# Altium schematic sheet Sheet1.SchDoc
size B; PageSetup: Record=PageOptions|CenterHorizontal=True|CenterVertical=True|PrintScale=1.09|XCorrection=1.00|YCorrection=1.00|PrintKind=1|BorderSize=5000000|LeftOffset=0|BottomOffset=0|Orientation=2|PaperLength=4318|PaperWidth=2794|Scale=100|PaperSource=7|PrintQuality=600|MediaType=1|DitherType=10|PaperKind=11" x 17"|PrintScaleMode=1
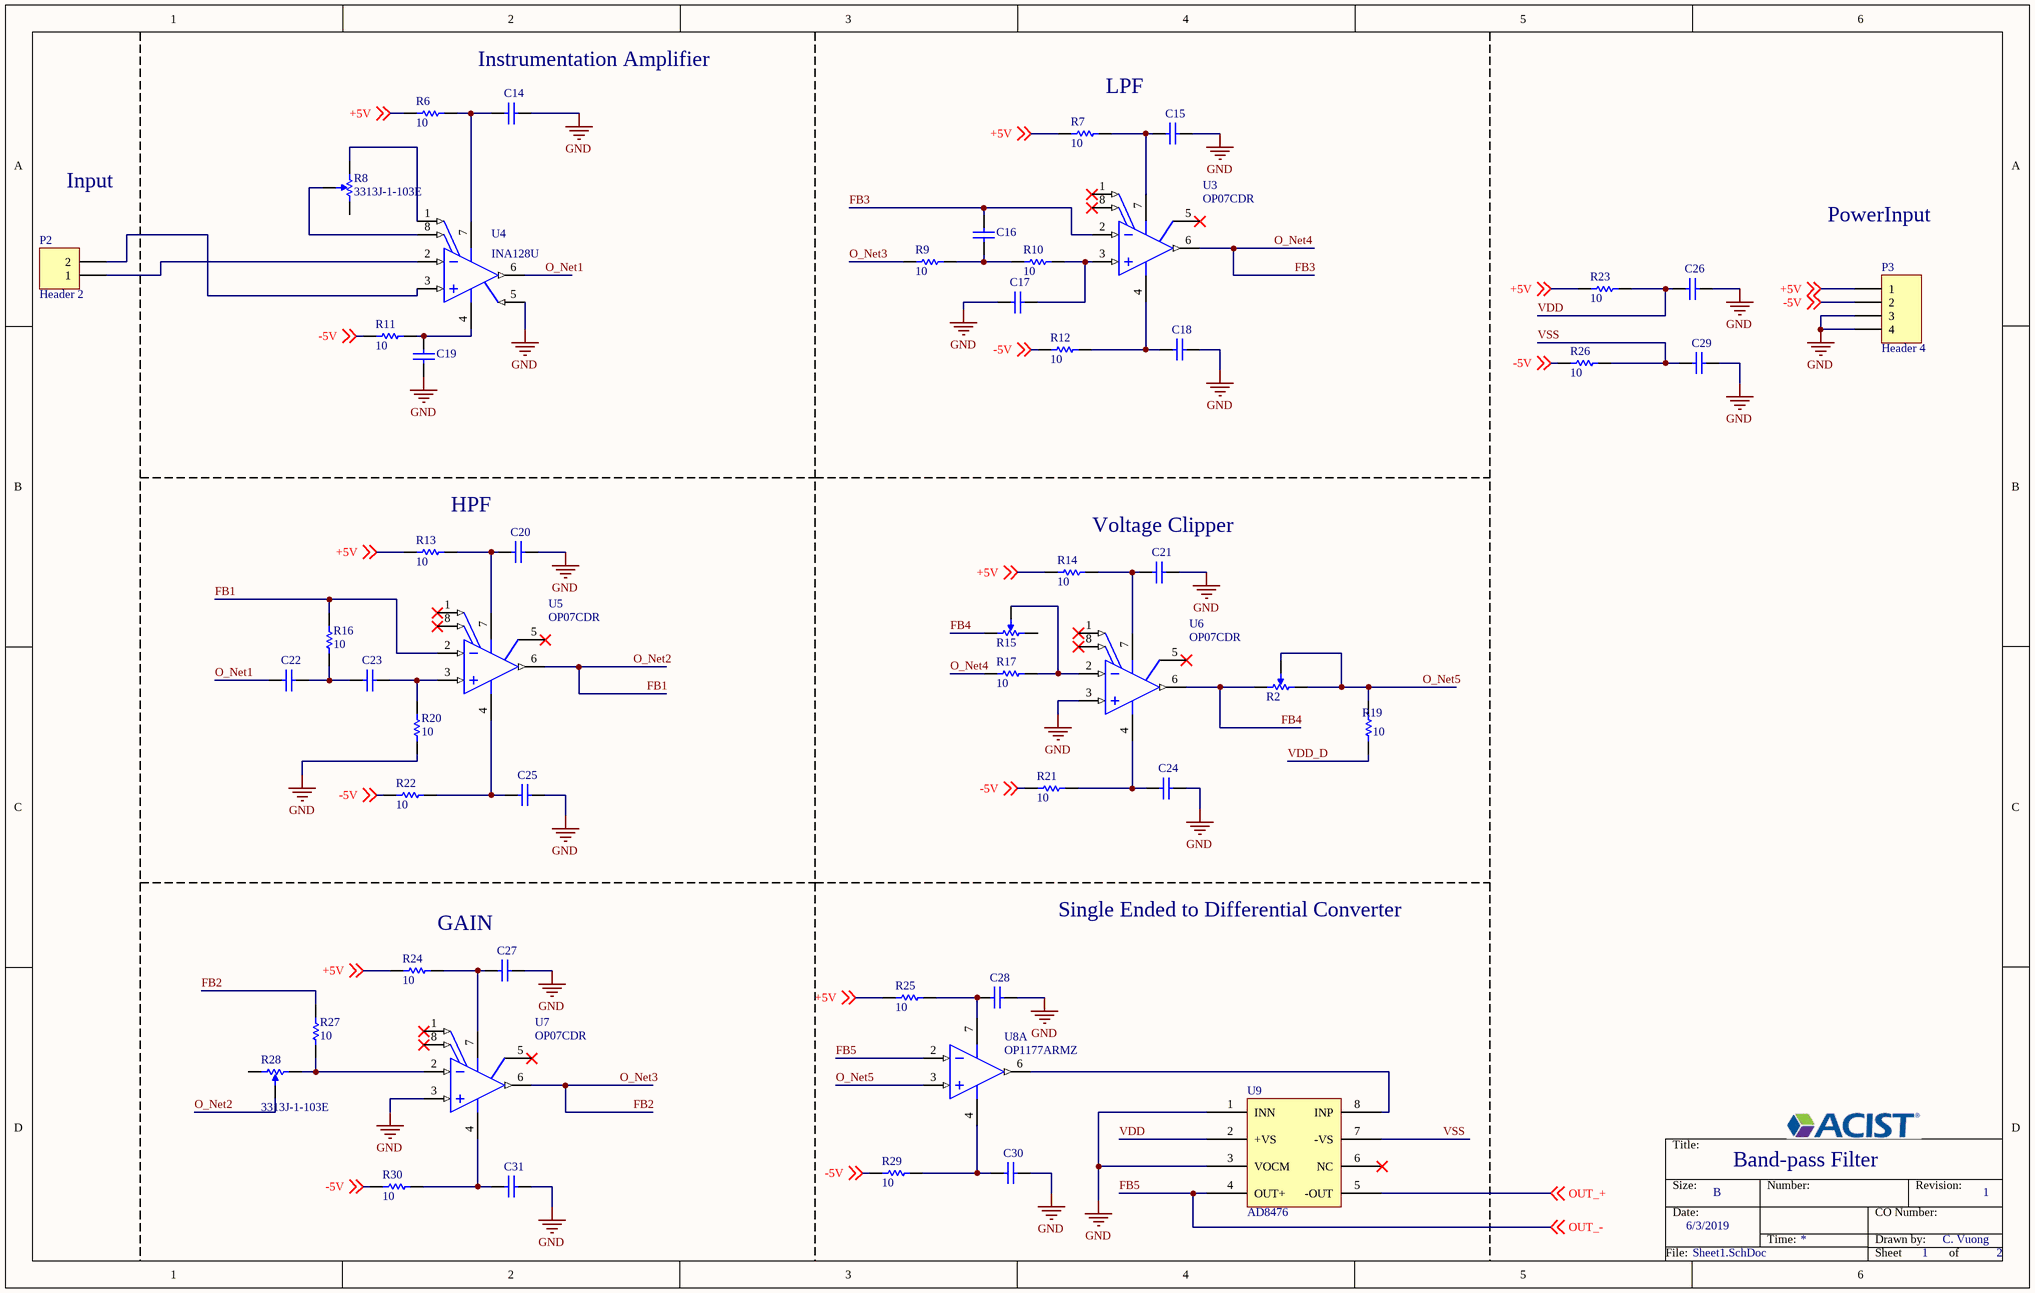
[diagram p0: Sheet1.SchDoc]

## Parts
C14  C1608X5R1A106K080AC  [CAPC1608X90X20ML10]  (value not drawn)
C15  C1608X5R1A106K080AC  [CAPC1608X90X20ML10]  (value not drawn)
C16  C1608X5R1A106K080AC  [CAPC1608X90X20ML10]  (value not drawn)
C17  C1608X5R1A106K080AC  [CAPC1608X90X20ML10]  (value not drawn)
C18  C1608X5R1A106K080AC  [CAPC1608X90X20ML10]  (value not drawn)
C19  C1608X5R1A106K080AC  [CAPC1608X90X20ML10]  (value not drawn)
C20  C1608X5R1A106K080AC  [CAPC1608X90X20ML10]  (value not drawn)
C21  C1608X5R1A106K080AC  [CAPC1608X90X20ML10]  (value not drawn)
C22  C1608X5R1A106K080AC  [CAPC1608X90X20ML10]  (value not drawn)
C23  C1608X5R1A106K080AC  [CAPC1608X90X20ML10]  (value not drawn)
C24  C1608X5R1A106K080AC  [CAPC1608X90X20ML10]  (value not drawn)
C25  C1608X5R1A106K080AC  [CAPC1608X90X20ML10]  (value not drawn)
C26  C1608X5R1A106K080AC  [CAPC1608X90X20ML10]  (value not drawn)
C27  C1608X5R1A106K080AC  [CAPC1608X90X20ML10]  (value not drawn)
C28  C1608X5R1A106K080AC  [CAPC1608X90X20ML10]  (value not drawn)
C29  C1608X5R1A106K080AC  [CAPC1608X90X20ML10]  (value not drawn)
C30  C1608X5R1A106K080AC  [CAPC1608X90X20ML10]  (value not drawn)
C31  C1608X5R1A106K080AC  [CAPC1608X90X20ML10]  (value not drawn)
P2  Header 2  [HDR1X2]
P3  Header 4  [HDR1X4]
R2  3313J-1-103E  [BOUR-3313J-1_V]  (value not drawn)
R6  10  [RESC1608X50X30LL20T20]
R7  10  [RESC1608X50X30LL20T20]
R8  3313J-1-103E  [BOUR-3313J-1_V]
R9  10  [RESC1608X50X30LL20T20]
R10  10  [RESC1608X50X30LL20T20]
R11  10  [RESC1608X50X30LL20T20]
R12  10  [RESC1608X50X30LL20T20]
R13  10  [RESC1608X50X30LL20T20]
R14  10  [RESC1608X50X30LL20T20]
R15  3313J-1-103E  [BOUR-3313J-1_V]  (value not drawn)
R16  10  [RESC1608X50X30LL20T20]
R17  10  [RESC1608X50X30LL20T20]
R19  10  [RESC1608X50X30LL20T20]
R20  10  [RESC1608X50X30LL20T20]
R21  10  [RESC1608X50X30LL20T20]
R22  10  [RESC1608X50X30LL20T20]
R23  10  [RESC1608X50X30LL20T20]
R24  10  [RESC1608X50X30LL20T20]
R25  10  [RESC1608X50X30LL20T20]
R26  10  [RESC1608X50X30LL20T20]
R27  10  [RESC1608X50X30LL20T20]
R28  3313J-1-103E  [BOUR-3313J-1_V]
R29  10  [RESC1608X50X30LL20T20]
R30  10  [RESC1608X50X30LL20T20]
U3  OP07CDR  [D0008A_M]
U4  INA128U  [D0008A_N]
U5  OP07CDR  [D0008A_M]
U6  OP07CDR  [D0008A_M]
U7  OP07CDR  [D0008A_M]
U8  OP1177ARMZ  [ADI-RM-8_M]  (part A of 2)
U9  AD8476  [MSOP8]

## Nets
GND: C14.1 C15.1 C17.1 C18.1 C19.1 C20.1 C21.1 C24.1 C25.1 C26.1 C27.1 C28.1 C29.1 C30.1 C31.1 P3.3 P3.4 R20.2 U4.5(REF) U6.3(IN+) U7.3(IN+) U9.1(INN) U9.3(VOCM)
+5V: P3.1 R6.2 R7.2 R13.2 R14.2 R23.2 R24.2 R25.2 ; off-sheet +5V
-5V: P3.2 R11.2 R12.2 R21.2 R22.2 R26.2 R29.2 R30.2 ; off-sheet -5V
FB1: R16.1 R28.2 U5.2(IN-) U5.6(OUT)  [also labelled O_Net2]
FB2: R9.2 R27.1 U7.6(OUT)  [also labelled O_Net3]
FB3: C16.1 R17.2 U3.2(IN-) U3.6(OUT)  [also labelled O_Net4]
FB4: R2.3 R15.3 U6.6(OUT)
FB5: U8.2(-IN) U9.4(OUT+) ; off-sheet OUT_-  [also labelled OUT_-]
O_Net1: C22.2 U4.6(VO)
O_Net5: R2.1 R2.2 R19.1 U8.3(+IN)
OUT_+: U9.5(-OUT) ; off-sheet OUT_+
VDD: C26.2 R23.1 U9.2(+VS)
VDD_D: R19.2
VSS: C29.2 R26.1 U9.7(-VS)
NetC14_2: C14.2 R6.1 U4.7(V+)
NetC15_2: C15.2 R7.1 U3.7(VCC+)
NetC16_2: C16.2 R9.1 R10.2
NetC17_2: C17.2 R10.1 U3.3(IN+)
NetC18_2: C18.2 R12.1 U3.4(VCC-)
NetC19_2: C19.2 R11.1 U4.4(V-)
NetC20_2: C20.2 R13.1 U5.7(VCC+)
NetC21_2: C21.2 R14.1 U6.7(VCC+)
NetC22_1: C22.1 C23.2 R16.2
NetC23_1: C23.1 R20.1 U5.3(IN+)
NetC24_2: C24.2 R21.1 U6.4(VCC-)
NetC25_2: C25.2 R22.1 U5.4(VCC-)
NetC27_2: C27.2 R24.1 U7.7(VCC+)
NetC28_2: C28.2 R25.1 U8.7(+V)
NetC30_2: C30.2 R29.1 U8.4(-V)
NetC31_2: C31.2 R30.1 U7.4(VCC-)
NetP2_1: P2.1 U4.2(VIN-)
NetP2_2: P2.2 U4.3(VIN+)
NetR8_1: R8.1 U4.1(RG)
NetR8_2: R8.2 U4.8(RG)
NetR15_2: R15.2 R17.1 U6.2(IN-)
NetR27_2: R27.2 R28.3 U7.2(IN-)
NetU8_6: U8.6(OUT) U9.8(INP)

Not connected (* = marked no-connect by the designer): R8 3; R15 1; R28 1; U3 1(OFFSET_N1)* 5(NC)* 8(OFFSET_N2)*; U5 1(OFFSET_N1)* 5(NC)* 8(OFFSET_N2)*; U6 1(OFFSET_N1)* 5(NC)* 8(OFFSET_N2)*; U7 1(OFFSET_N1)* 5(NC)* 8(OFFSET_N2)*; U9 6(NC)*

## Notes on the sheet
- Instrumentation Amplifier
- LPF
- Input
- PowerInput
- HPF
- Voltage Clipper
- GAIN
- Single Ended to Differential Converter
- Band-pass Filter
- 6/3/2019
- C. Vuong
- 1
- 2
- Title:
- Size:
- Date:
- B
- Number:
- Time:
- CO Number:
- Drawn by:
- Revision:
- File:
- Sheet
- of

## Library data of the parts
C14-C31 = CMP-2000-04979-1: Chip Capacitor, 10 uF, +/- 10%, 10 V, -55 to 85 degC, 0603 (1608 Metric), RoHS, Tape and Reel; PCN Part Number: MLCCPartNumberChange30/Nov/2012; Manufacturer: TDK; Temperature Coefficient: X5R; Product Training Modules: CSeriesGeneralApplicationsSEAT,CCV,andTVCLDesignToolsGuidetoReplacinganElectrolyticCapacitorwithanMLCC; Online Catalog: CSeries,GeneralPurpose; Voltage - Rated: 10V; Other Names: 445-7486-1; Capacitance: 10µF; Design Resources: 20WNon-IsolatedBuckLEDDriverUsingPLLNK460KG; Kits: 445-9003-KIT-ND-KITCAPCERHICAPMLCCSMD; Height - Seated (Max): -; Family: CeramicCapacitors; Package Description: 2-Pin Surface Mount Device, Body 1.6 x 0.8 mm; Category: Capacitors; Datasheet Version: Mar-15; RoHS Information: RoHSCertificate-MLCC; Thickness (Max): 0.035"(0.90mm); Operating Temperature: -55degC~85degC; Package Reference: 603; Series: C; Applications: GeneralPurpose; Datasheet URL: http://download.siliconexpert.com/pdfs/2015/4/21/15/54/45/779/tdk_/manual/37024850441143360mlcc_commercial_general_en.pdf; Features: -; Lead Style: -; Lead Spacing: -; Ratings: -; Size / Dimension: 0.063"Lx0.031"W(1.60mmx0.80mm); Tolerance: ±10%; Mounting Type: SurfaceMount,MLCC; Standard Package: 1; Package / Case: 0603(1608Metric); Manufacturer URL: http://www.tdk.com/; Packaging: CutTape(CT)
P2 = Header 2: Header, 2-Pin; LatestRevisionDate: 17-Jul-2002; LatestRevisionNote: Re-released for DXP Platform.; Publisher: Altium Limited
P3 = Header 4: Header, 4-Pin; LatestRevisionDate: 17-Jul-2002; LatestRevisionNote: Re-released for DXP Platform.; Publisher: Altium Limited
R2 R8 R15 R28 = CMP-2000-05585-1: Trimming Potentiometer, 10 KOhm, -55 to 125 degC, 3-Pin SMD, RoHS, Tape and Reel; Manufacturer: Bourns; Resistance Tolerance: ±20%; Track Resistance: 10kohm; SVHC: NoSVHC(16-Jun-2014); No. of Turns: 1; Temperature Coefficient: ±100ppm/°C; Power Rating: 125mW; Potentiometer Mounting: SMD; RoHS Compliant: Yes; Datasheet URL: http://www.bourns.com/docs/Product-Datasheets/3313.pdf; Mounting Technology: SurfaceMount; Manufacturer URL: http://www.bourns.com/; Package Description: 3-Pin Surface Mount Device, Body 3.5 x 3.2 mm, Pitch 1.15 mm; Package Reference: 3313J-1; Datasheet Version: 05/2016
R6 R7 R9-R14 R16 R17 R19-R27 R29 R30 = CMP-2000-02559-1: Part Number: RR0816P-241-D; Manufacturer: Susumu
U3 U5-U7 = CMP-0015-00070-2: Low-Offset Voltage Operational Amplifier, 6 to 36 V, 0 to 70 degC, 8-pin SOIC (D8), Green (RoHS & no Sb/Br); Manufacturer: Texas Instruments; Iq per channel(Max)(mA): 5; Total Supply Voltage(Min)(+5V is 5, +/-5V is 10): 6; IIB(Max)(pA): 7000; GBW(Typ)(MHz): 0.6; Vio (25C)(Max)(mV): 0.15; Sub Family: General Purpose Amplifier, High Supply Voltage Amplifier (>=30V), Low Noise Amp (<=10nV/rtHz), Low Offset Voltage Amplifier (<=500uV); Slew Rate(Typ)(V/us): 0.3; Number of Channels: 1; Vn at 1kHz(Typ)(nV/rtHz): 9.8; Offset Drift(Typ)(uV/C): 0.5; Rating: Catalog; CMRR(Min)(dB): 100; Total Supply Voltage(Max)(+5V is 5, +/-5V is 10): 36; PackageReference: D0008A; ComponentLink2Description: Datasheet; PartNumber: OP07CDR; Eco-Plan: Green (RoHS & no Sb/Br); DatasheetVersion: SLOS099E; ComponentLink2URL: http://www.ti.com/lit/ds/symlink/op07c.pdf; PackageDescription: 8-Pin Plastic Small Outline, Body 4.9 x 3.9 mm, Pitch 1.27 mm; ComponentLink1Description: Manufacturer URL; PackageVersion: 4040047-3/M, 06/2011; Code_JEDEC: MS-012; ComponentLink3URL: http://www.ti.com/litv/pdf/msoi002j; Mounting Technology: Surface Mount; ComponentLink3Description: Package Specification; ComponentLink1URL: http://www.ti.com/
U4 = CMP-0992-00017-2: Precision, Low Power Instrumentation Amplifier, -40 to 85 degC, 8-pin SOIC (D8), Green (RoHS & no Sb/Br); Manufacturer: Texas Instruments; Gain(V/V): 1 to 10000; Noise at 1kHz(Typ)(nV/rt(Hz)): 8; Number of Channels: 1; Vs(Max)(V): 36; Vs(Min)(V): 4.5; Input Offset (+/-)(Max)(uV): 50; Input Bias Current (+/-)(Max)(nA): 5; Non-Linearity (+/-)(Max)(%): 0.002; CMRR(Min)(dB): 120; Input Offset Drift (+/-)(Max)(uV/Degrees Celsius): 0.5; SubFamily: Dual Supply; Quiescent Current (+/-)(Typ)(mA): 0.7; ComponentLink1URL: http://www.ti.com/; PackageVersion: 4040047-3/M, 06/2011; PackageDescription: 8-Pin Plastic Small Outline, Body 4.9 x 3.9 mm, Pitch 1.27 mm; Mounting Technology: Surface Mount; ComponentLink3URL: http://www.ti.com/litv/pdf/msoi002j; ComponentLink3Description: Package Specification; PackageReference: D0008A; PartNumber: INA128U; Code_JEDEC: MS-012; ComponentLink2Description: Datasheet; Eco-Plan: Green (RoHS & no Sb/Br); DatasheetVersion: SBOS051B; ComponentLink2URL: http://www.ti.com/general/docs/lit/getliterature.tsp?genericPartNumber=INA128&fileType=pdf; ComponentLink1Description: Manufacturer URL
U8 = ADI-AD_ADA_OPXXXX-X-8: Single Channel Wide Bandwidth Operational Amplifier, 1.3 MHz BW, 700 mV/us SR, Industrial, 8-pin SOP (RM-8), Tube; Generic Part Number: OP1177; Manufacturer: Analog Devices; Input Bias Current: 500pA; Amplifiers Per Package: 1; Input Offset Voltage: 15uV; V Span Max: 36V; V Span Min: 5V; Small Signal Bandwidth: 1.3MHz; Iq/Amp: 500uA; ComponentLink1URL: http://www.analog.com/en/index.html; PartNumber: OP1177ARMZ; ComponentLink4URL: http://www.analog.com/en/all-operational-amplifiers-op-amps/operational-amplifiers-op-amps/op1177/products/product.html#product-recommendations; RevisionNote: Reference Circuit URL fixed; Slew Rate: 700mV/us; ComponentLink3Description: Package Specification; Mounting Technology: Surface Mount; ComponentLink1Description: Manufacturer URL; DatasheetVersion: Rev. G; ComponentLink2Description: Datasheet; ComponentLink4Description: Reference Circuit; ComponentLink3URL: http://www.analog.com/static/imported-files/packages/PKG_PDF/MSOP%28RM%29/RM_8.pdf; PackageDescription: 8-Pin Mini Small Outline Package, Body 3 x 3 mm, Pitch 0.65 mm; Code_JEDEC: MO-187-AA; ComponentLink2URL: http://www.analog.com/static/imported-files/data_sheets/OP1177_2177_4177.pdf; PackageReference: RM-8